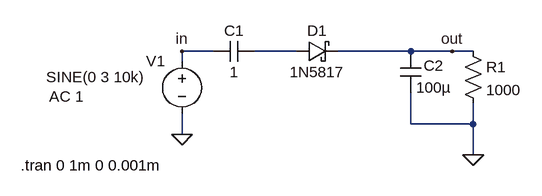
[diagram p0: schematic rectifier_with_schottky.asc]
rectifier_with_schottky.asc, the LTspice schematic file:
Version 4
SHEET 1 880 680
WIRE -192 -240 -240 -240
WIRE -64 -240 -128 -240
WIRE 112 -240 0 -240
WIRE 176 -240 112 -240
WIRE 208 -240 176 -240
WIRE -240 -224 -240 -240
WIRE 112 -128 112 -176
WIRE 208 -128 208 -160
WIRE 208 -128 112 -128
WIRE -240 -112 -240 -144
WIRE 208 -80 208 -128
FLAG 208 -80 0
FLAG -240 -112 0
FLAG 176 -240 out
FLAG -240 -240 in
SYMBOL schottky -64 -224 R270
WINDOW 0 32 32 VTop 2
WINDOW 3 0 32 VBottom 2
SYMATTR InstName D1
SYMATTR Value 1N5817
SYMATTR Description Diode
SYMATTR Type diode
SYMBOL res 192 -256 R0
SYMATTR InstName R1
SYMATTR Value 1000
SYMBOL cap -128 -256 R90
WINDOW 0 0 32 VBottom 2
WINDOW 3 32 32 VTop 2
SYMATTR InstName C1
SYMATTR Value 1
SYMBOL voltage -240 -240 R0
WINDOW 123 -204 70 Left 2
WINDOW 39 0 0 Left 0
WINDOW 3 -209 40 Left 2
WINDOW 0 -55 15 Left 2
SYMATTR Value2 AC 1
SYMATTR Value SINE(0 3 10k)
SYMATTR InstName V1
SYMBOL cap 96 -240 R0
WINDOW 0 36 22 Left 2
SYMATTR InstName C2
SYMATTR Value 100µ
TEXT -488 -64 Left 2 !.tran 0 1m 0 0.001m

The netlist it stands for:
* rectifier_with_schottky.asc
D1 N001 out 1N5817
R1 out 0 1000
C1 N001 in 1
V1 in 0 SINE(0 3 10k) AC 1
C2 out 0 100µ
.model D D
.lib standard.dio
.tran 0 1m 0 0.001m
.backanno
.end